# Altium schematic sheet INL.SchDoc
size A4
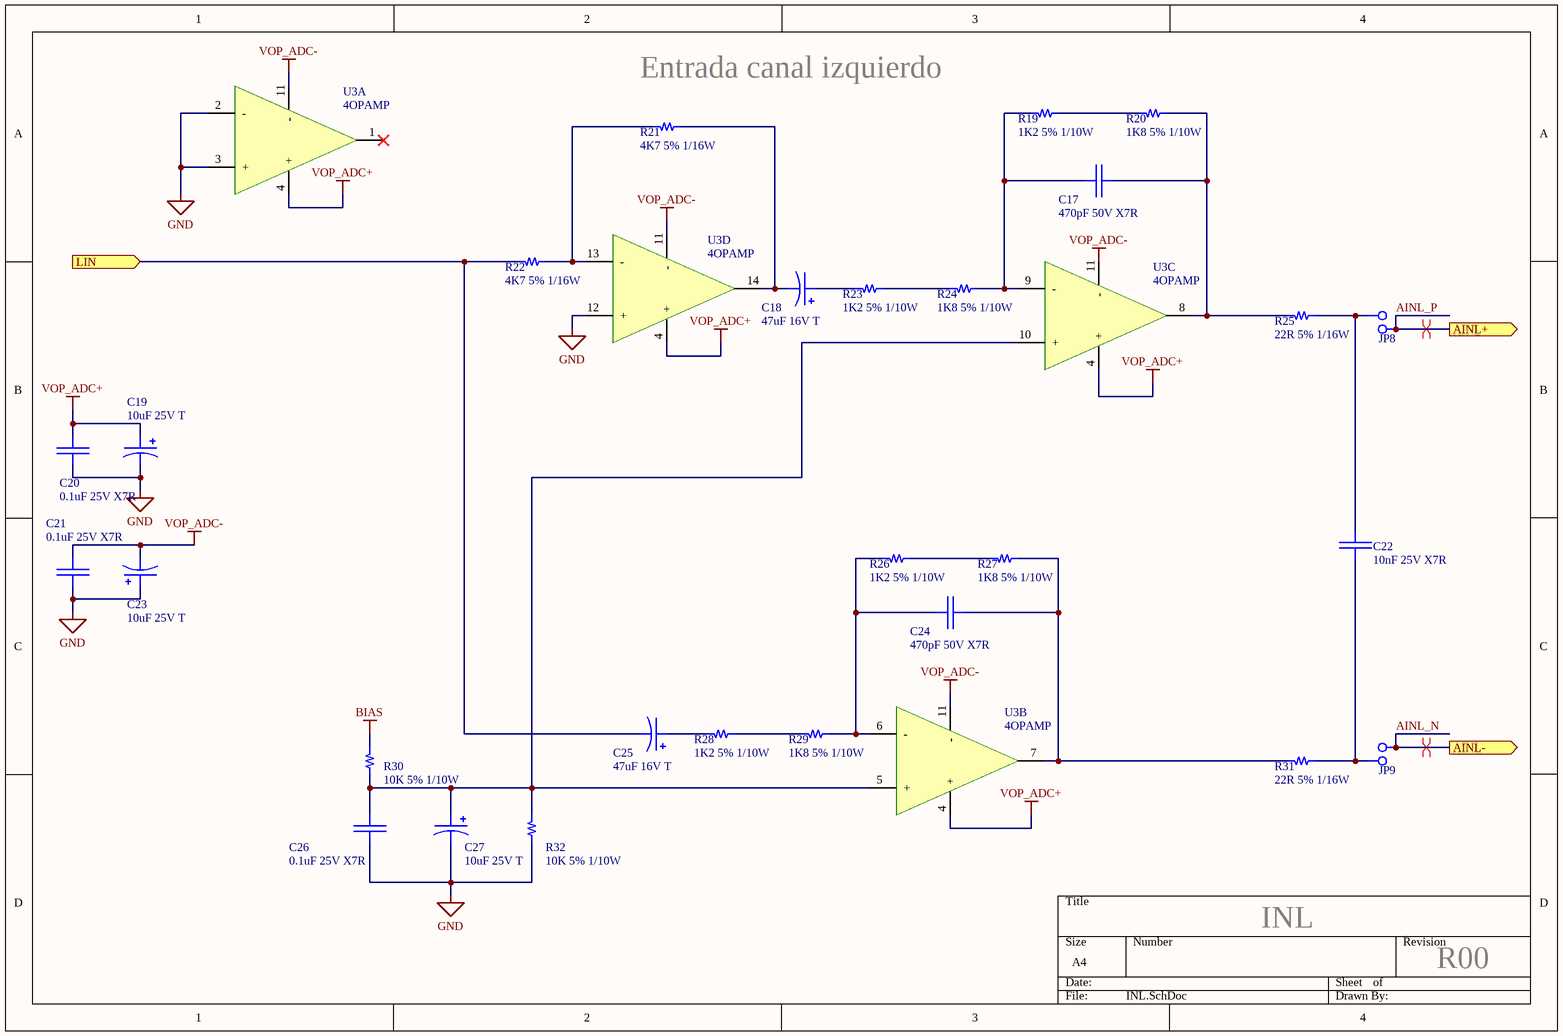
[diagram p0: INL.SchDoc]

## Parts
C17  470pF 50V X7R  [C_0805]
C18  47uF 16V T  [TANT]
C19  10uF 25V T  [TANT]
C20  0.1uF 25V X7R  [C_0805]
C21  0.1uF 25V X7R  [C_0805]
C22  10nF 25V X7R  [C_0805]
C23  10uF 25V T  [TANT]
C24  470pF 50V X7R  [C_0805]
C25  47uF 16V T  [TANT]
C26  0.1uF 25V X7R  [C_0805]
C27  10uF 25V T  [TANT]
JP8  Jumper 2x1  [Conn_2_1]  (value not drawn)
JP9  Jumper 2x1  [Conn_2_1]  (value not drawn)
R19  1K2 5% 1/10W  [R_0805]
R20  1K8 5% 1/10W  [R_0805]
R21  4K7 5% 1/16W  [R_0805]
R22  4K7 5% 1/16W  [R_0805]
R23  1K2 5% 1/10W  [R_0805]
R24  1K8 5% 1/10W  [R_0805]
R25  22R 5% 1/16W  [R_0805]
R26  1K2 5% 1/10W  [R_0805]
R27  1K8 5% 1/10W  [R_0805]
R28  1K2 5% 1/10W  [R_0805]
R29  1K8 5% 1/10W  [R_0805]
R30  10K 5% 1/10W  [R_0805]
R31  22R 5% 1/16W  [R_0805]
R32  10K 5% 1/10W  [R_0805]
U3  4OPAMP  [SOIC14]  (parts A,B,C,D of 4)

## Ports
AINL+ (out), AINL- (out), LIN (in)

## Nets
BIAS: R30.2
GND: C19.2 C20.2 C21.2 C23.1 C26.2 C27.2 R32.1 U3.2(-) U3.3(+) U3.12(+)
VOP_ADC+: C19.1 C20.1 U3.4(+)
VOP_ADC-: C21.1 C23.2 U3.11(-)
AINL_N: JP9.1 ; port AINL-
AINL_P: JP8.2 ; port AINL+
LIN: C25.2 R22.2 ; port LIN
NetC17_1: C17.1 R19.2 R24.1 U3.9(-)
NetC17_2: C17.2 R20.1 R25.2 U3.8(OUT)
NetC18_1: C18.1 R23.2
NetC18_2: C18.2 R21.1 U3.14(OUT)
NetC22_1: C22.1 JP9.2 R31.1
NetC22_2: C22.2 JP8.1 R25.1
NetC24_1: C24.1 R26.2 R29.1 U3.6(-)
NetC24_2: C24.2 R27.1 R31.2 U3.7(OUT)
NetC25_1: C25.1 R28.2
NetC26_1: C26.1 C27.1 R30.1 R32.2 U3.5(+) U3.10(+)
NetR19_1: R19.1 R20.2
NetR21_2: R21.2 R22.1 U3.13(-)
NetR23_1: R23.1 R24.2
NetR26_1: R26.1 R27.2
NetR28_1: R28.1 R29.2

Not connected (* = marked no-connect by the designer): U3 1(OUT)*

## Layout directives
differential pair: AINL_N, AINL_P

## Notes on the sheet
- Entrada canal izquierdo
- INL
- R00

## Library data of the parts
C17 C24 = Capacitor: Capacitor de placas paralelas; Encapsulado: 0805; Cod. Proveedor: -; Proveedor: -
C18 C19 C23 C25 C27 = CapaPol: Capacitor polarizado; Encapsulado: TH; Cod. Proveedor: -; Proveedor: -
C20 C21 = Capacitor: Capacitor de placas paralelas; Cod. Proveedor: CA3289100; Encapsulado: 0603; Proveedor: Elemon
C22 = Capacitor: Capacitor de placas paralelas; Cod. Proveedor: CA3289050; Encapsulado: 0603; Proveedor: Elemon
C26 = Capacitor: Capacitor de placas paralelas
R19 R23 R26 R28 R30 R32 = Resistor: Resistencia; Encapsulado: 0805; Cod. Proveedor: -; Proveedor: -
R20 R24 R27 R29 = Resistor: Resistencia; Cod. Proveedor: RS3896200; Encapsulado: 0805; Proveedor: Elemon
R21 = Resistor: Resistencia; Cod. Proveedor: RS3896225; Proveedor: Elemon; Encapsulado: 0805
R22 = Resistor: Resistencia; Proveedor: Elemon; Cod. Proveedor: RS3896225; Encapsulado: 0805
R25 R31 = Resistor: Resistencia; Encapsulado: 0603; Cod. Proveedor: -; Proveedor: -
U3 = 4OPAMP: Integrado con 4 operacionales